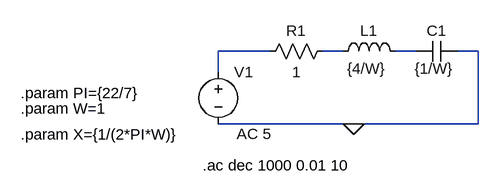
[diagram p0: schematic RLC serie.asc]
RLC serie.asc, the LTspice schematic file:
Version 4
SHEET 1 880 680
WIRE 48 96 -32 96
WIRE 160 96 128 96
WIRE 272 96 240 96
WIRE 368 96 336 96
WIRE -32 128 -32 96
WIRE 176 208 -32 208
WIRE 368 208 368 96
WIRE 368 208 176 208
FLAG 176 208 0
SYMBOL voltage -32 112 R0
WINDOW 3 28 83 Left 2
WINDOW 123 28 111 Left 2
WINDOW 39 0 0 Left 0
SYMATTR Value ""
SYMATTR Value2 AC 5
SYMATTR InstName V1
SYMBOL res 144 80 R90
WINDOW 0 0 56 VBottom 2
WINDOW 3 32 56 VTop 2
SYMATTR InstName R1
SYMATTR Value 1
SYMBOL ind 144 112 R270
WINDOW 0 32 56 VTop 2
WINDOW 3 -26 52 VTop 2
SYMATTR InstName L1
SYMATTR Value {4/W}
SYMBOL cap 336 80 R90
WINDOW 0 0 32 VBottom 2
WINDOW 3 58 36 VBottom 2
SYMATTR InstName C1
SYMATTR Value {1/W}
TEXT -56 272 Left 2 !.ac dec 1000 0.01 10
TEXT -336 184 Left 2 !.param W=1
TEXT -336 224 Left 2 !.param X={1/(2*PI*W)}
TEXT -336 160 Left 2 !.param PI={22/7}

The netlist it stands for:
* RLC serie.asc
V1 N001 0 AC 5
R1 N002 N001 1
L1 N002 N003 {4/W}
C1 0 N003 {1/W}
.ac dec 1000 0.01 10
.param W=1
.param X={1/(2*PI*W)}
.param PI={22/7}
.backanno
.end